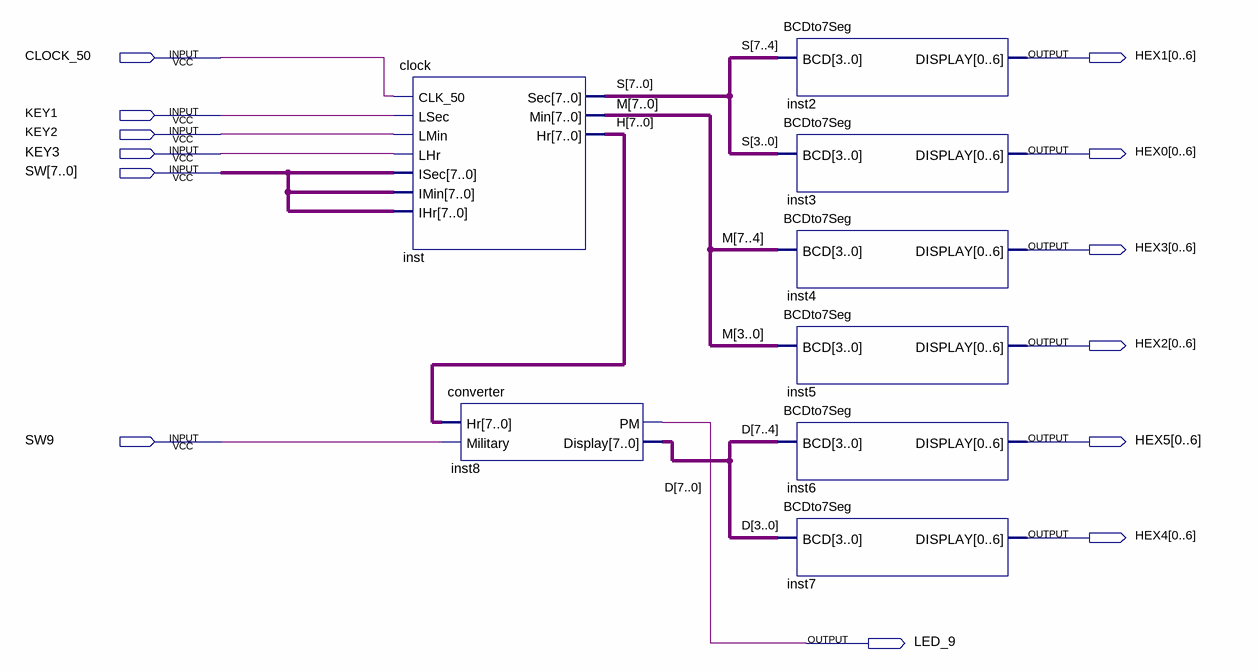
[diagram p0: schematic sheet]
// Quartus schematic Lab3.bdf as structural Verilog: 8 symbols, 13 pins
module Lab3 (
  input  CLOCK_50,
  input  KEY1,
  input  KEY2,
  input  KEY3,
  input  [7:0] SW,
  input  SW9,
  output [0:6] HEX1,
  output [0:6] HEX0,
  output [0:6] HEX3,
  output [0:6] HEX2,
  output [0:6] HEX5,
  output [0:6] HEX4,
  output LED_9
);

  wire [7:0] D, H, M, S;

  clock inst (
    .CLK_50(CLOCK_50), .LSec(KEY1), .LMin(KEY2), .LHr(KEY3), .ISec(SW), .IMin(SW), .IHr(SW), .Sec(S),
    .Min(M), .Hr(H));
  converter inst8 (.Hr(H), .Military(SW9), .PM(LED_9), .Display(D));
  BCDto7Seg inst2 (.BCD(S[7:4]), .DISPLAY(HEX1));
  BCDto7Seg inst3 (.BCD(S[3:0]), .DISPLAY(HEX0));
  BCDto7Seg inst4 (.BCD(M[7:4]), .DISPLAY(HEX3));
  BCDto7Seg inst5 (.BCD(M[3:0]), .DISPLAY(HEX2));
  BCDto7Seg inst6 (.BCD(D[7:4]), .DISPLAY(HEX5));
  BCDto7Seg inst7 (.BCD(D[3:0]), .DISPLAY(HEX4));
endmodule
